# EAGLE schematic Mpr121Shield (EAGLE 7.4.0)
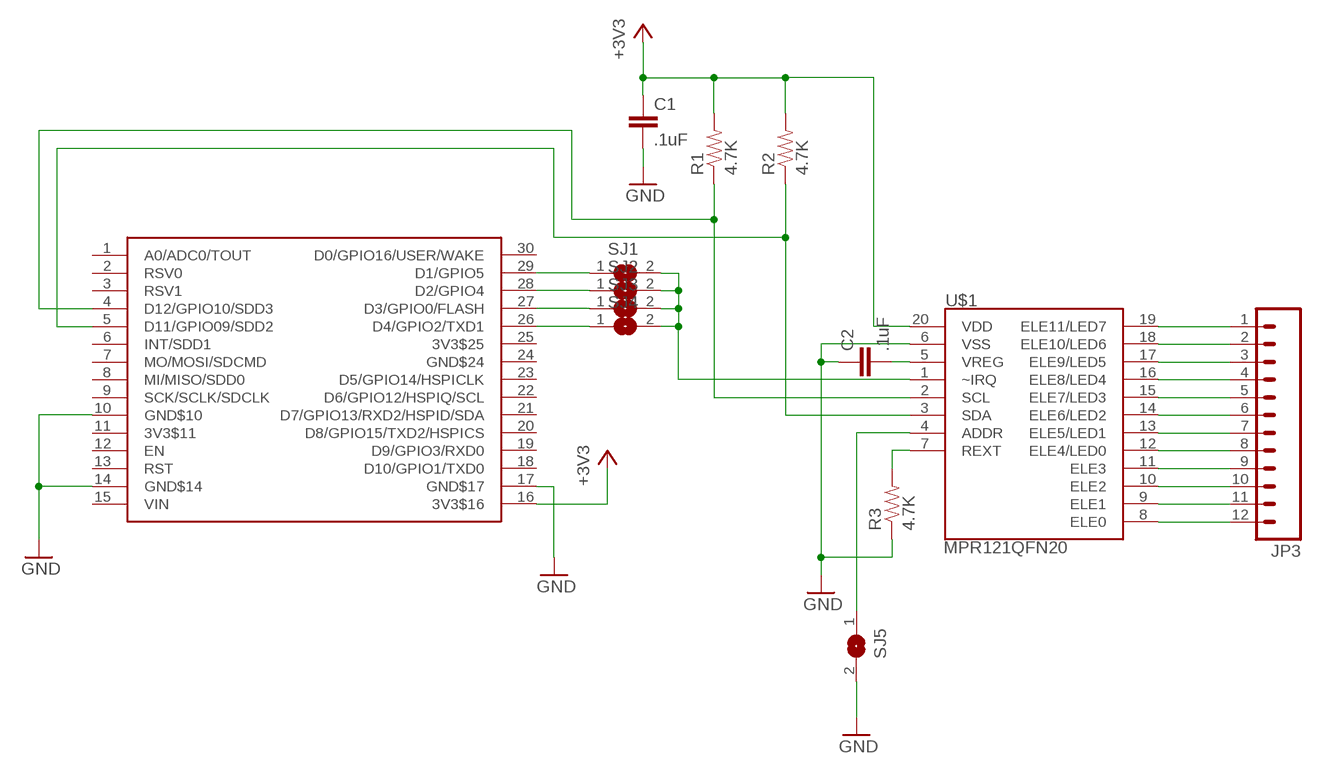
[diagram p0: schematic, sheet 1]

## Parts
C1  .1uF  CAP0603-CAP  [0603-CAP]
C2  .1uF  CAP0603-CAP  [0603-CAP]
JP3  M12NO_SILK  [1X12_NO_SILK]
R1  4.7K  RESISTOR0603-RES  [0603-RES]
R2  4.7K  RESISTOR0603-RES  [0603-RES]
R3  4.7K  RESISTOR0603-RES  [0603-RES]
SJ1  SJ  [SJ]
SJ2  SJ  [SJ]
SJ3  SJ  [SJ]
SJ4  SJ  [SJ]
SJ5  SJ  [SJ]
U$1  MPR121QFN20  [QFN-20-0.4MM]
U$2  NERDSHIELD  [NERDUINO_STACK]

## Nets
+3V3: C1.1 R1.2 R2.2 U$1.20(VDD) U$2.16(3V3$16)
GND: C1.2 C2.1 R3.1 SJ5.2 U$1.6(VSS) U$2.10(GND$10) U$2.14(GND$14) U$2.17(GND$17)
N$1: JP3.1 U$1.19(ELE11/LED7)
N$2: R1.1 U$1.2(SCL) U$2.4(D12/GPIO10/SDD3)
N$3: JP3.2 U$1.18(ELE10/LED6)
N$4: R2.1 U$1.3(SDA) U$2.5(D11/GPIO09/SDD2)
N$5: JP3.3 U$1.17(ELE9/LED5)
N$6: JP3.4 U$1.16(ELE8/LED4)
N$7: JP3.5 U$1.15(ELE7/LED3)
N$8: JP3.6 U$1.14(ELE6/LED2)
N$9: JP3.7 U$1.13(ELE5/LED1)
N$10: JP3.8 U$1.12(ELE4/LED0)
N$11: JP3.9 U$1.11(ELE3)
N$12: JP3.10 U$1.10(ELE2)
N$13: JP3.11 U$1.9(ELE1)
N$14: JP3.12 U$1.8(ELE0)
N$15: C2.2 U$1.5(VREG)
N$16: R3.2 U$1.7(REXT)
N$18: SJ5.1 U$1.4(ADDR)
N$19: SJ1.2 SJ2.2 SJ3.2 SJ4.2 U$1.1(~IRQ)
N$20: SJ1.1 U$2.29(D1/GPIO5)
N$21: SJ2.1 U$2.28(D2/GPIO4)
N$22: SJ3.1 U$2.27(D3/GPIO0/FLASH)
N$23: SJ4.1 U$2.26(D4/GPIO2/TXD1)
Unconnected: U$2.1(A0/ADC0/TOUT) U$2.2(RSV0) U$2.3(RSV1) U$2.6(INT/SDD1) U$2.7(MO/MOSI/SDCMD) U$2.8(MI/MISO/SDD0) U$2.9(SCK/SCLK/SDCLK) U$2.11(3V3$11) U$2.12(EN) U$2.13(RST) U$2.15(VIN) U$2.18(D10/GPIO1/TXD0) U$2.19(D9/GPIO3/RXD0) U$2.20(D8/GPIO15/TXD2/HSPICS) U$2.21(D7/GPIO13/RXD2/HSPID/SDA) U$2.22(D6/GPIO12/HSPIQ/SCL) U$2.23(D5/GPIO14/HSPICLK) U$2.24(GND$24) U$2.25(3V3$25) U$2.30(D0/GPIO16/USER/WAKE)

## Library data of the parts
C1 C2 = SparkFun:CAP: Capacitor Standard 0603 ceramic capacitor, and 0.1" leaded capacitor.
JP3 = SparkFun-Connectors:M12: Header 12 Standard 12-pin 0.1" header. Use with straight break away headers (SKU : PRT-00116), right angle break away headers (PRT-00553), swiss pins (PRT-00743), machine pins (PRT-00117), and female headers (PRT-00115).
R1-R3 = SparkFun:RESISTOR: Resistor Basic schematic elements and footprints for 0603, 1206, and PTH resistors.
SJ1-SJ5 = jumper:SJ: SMD solder JUMPER
U$1 = SparkFun-Sensors:MPR121: MPR121 Capacitive Touch Sensor Controller. Variant "V2" was created using an image import of the bottom of the IC. It matches metal to metal.
U$2 = NerduinoShieldLib:NERDSHIELD